# EAGLE design touch r.7 (EAGLE 7.2.0)
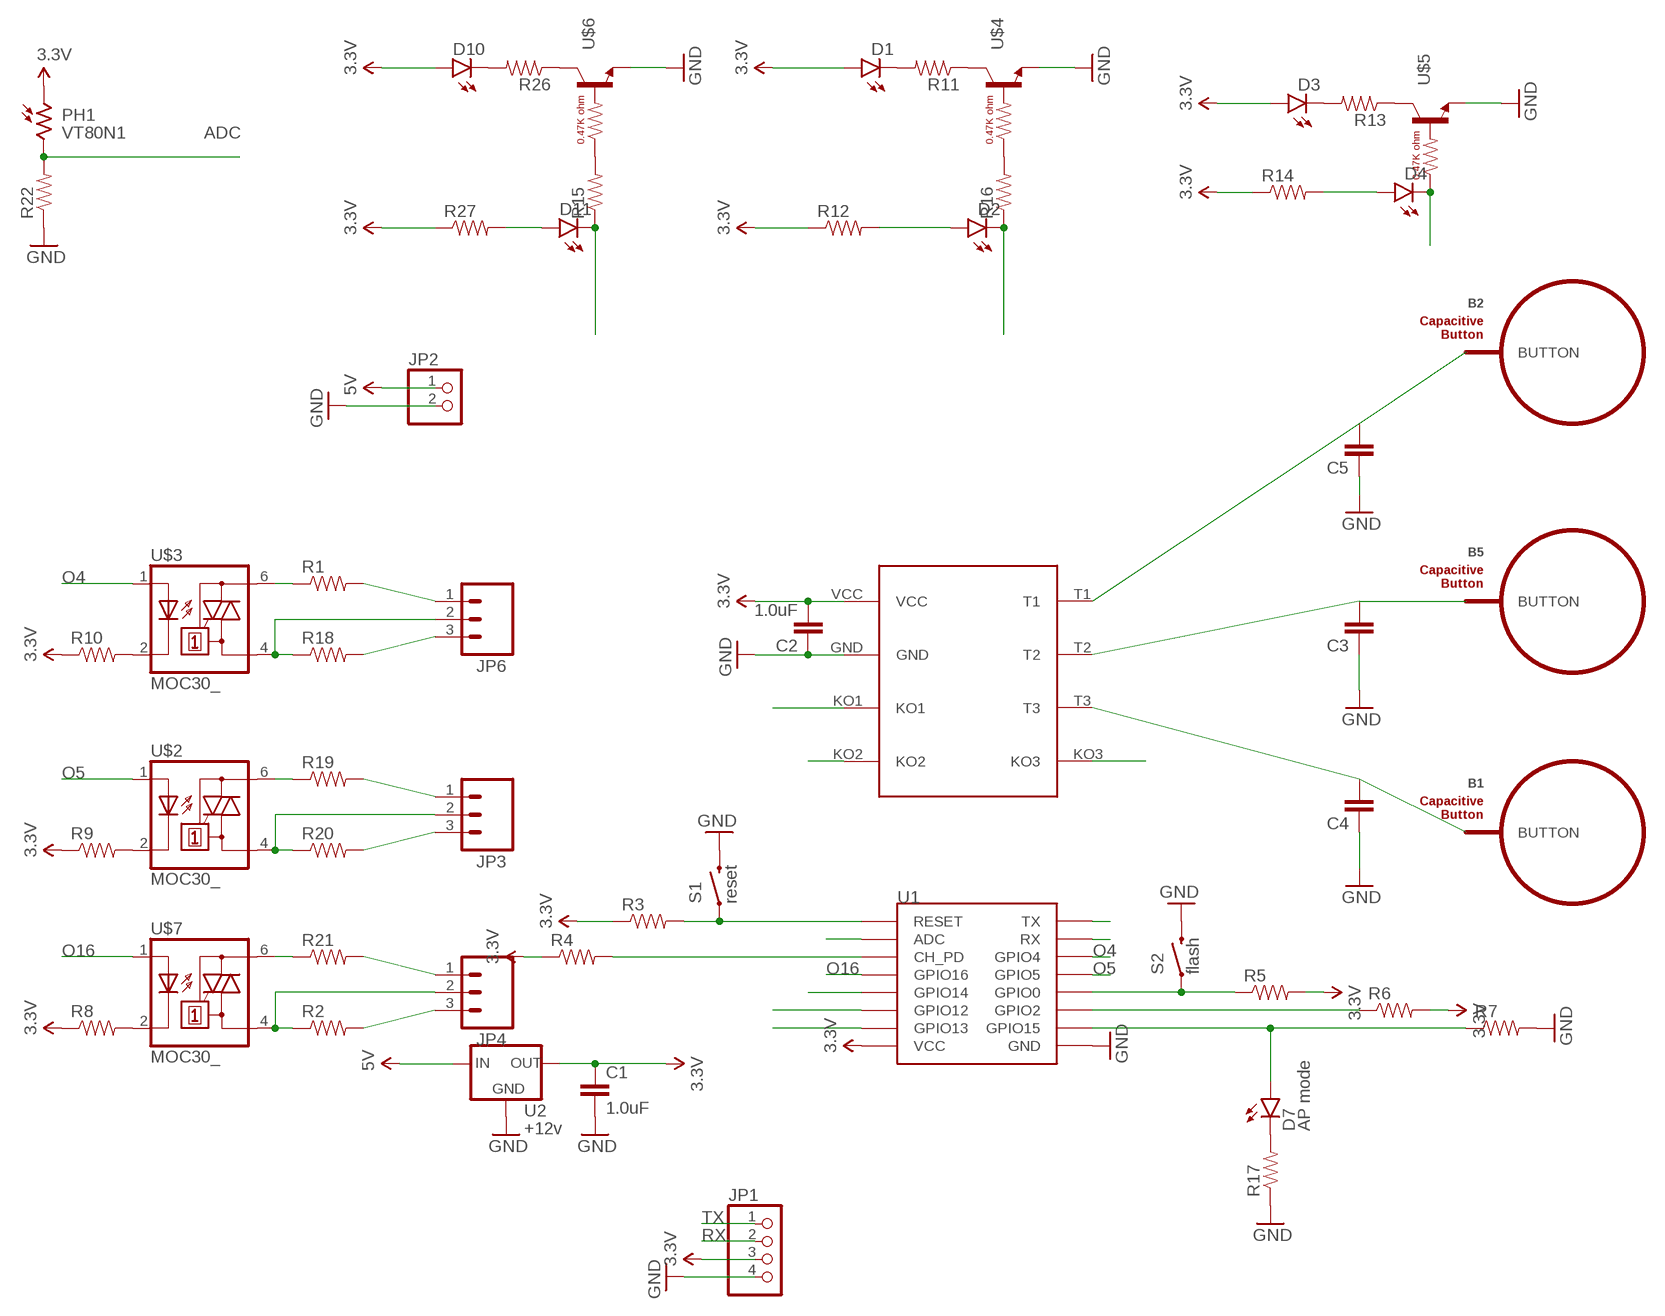
[diagram p0: schematic, sheet 1]

## Parts
B1  BUTTON_PASSIVE12MM  [BUTTON_PASSIVE_12MM]
B2  BUTTON_PASSIVE12MM  [BUTTON_PASSIVE_12MM]
B5  BUTTON_PASSIVE12MM  [BUTTON_PASSIVE_12MM]
C1  1.0uF  1.0UF50V10%(1206)  [1206]
C2  1.0uF  1.0UF50V10%(1206)  [1206]
C3  1.0UF-25V-+80/-20(0805)"  [0805-CAP]
C4  1.0UF-25V-+80/-20(0805)"  [0805-CAP]
C5  1.0UF-25V-+80/-20(0805)"  [0805-CAP]
D1  LED-GREENLILYPAD  [LED-1206]
D2  LED-GREENLILYPAD  [LED-1206]
D3  LED-GREENLILYPAD  [LED-1206]
D4  LED-GREENLILYPAD  [LED-1206]
D7  AP mode  LED-GREENLILYPAD  [LED-1206]
D10  LED-GREENLILYPAD  [LED-1206]
D11  LED-GREENLILYPAD  [LED-1206]
JP1  PINHD-1X4  [1X04]
JP2  PINHD-1X2  [1X02]
JP3  M03LONGPADS  [1X03_LONGPADS]
JP4  M03LONGPADS  [1X03_LONGPADS]
JP6  M03LONGPADS  [1X03_LONGPADS]
PH1  VT80N1  [VT800]
R1  RESISTORPTH-1/2W  [AXIAL-0.5]
R2  RESISTORPTH-1/2W  [AXIAL-0.5]
R3  0.3OHM-1/8W-1%(0805)  [0805]
R4  0.3OHM-1/8W-1%(0805)  [0805]
R5  0.3OHM-1/8W-1%(0805)  [0805]
R6  0.3OHM-1/8W-1%(0805)  [0805]
R7  0.3OHM-1/8W-1%(0805)  [0805]
R8  0.3OHM-1/8W-1%(0805)  [0805]
R9  0.3OHM-1/8W-1%(0805)  [0805]
R10  0.3OHM-1/8W-1%(0805)  [0805]
R11  0.3OHM-1/8W-1%(0805)  [0805]
R12  0.3OHM-1/8W-1%(0805)  [0805]
R13  0.3OHM-1/8W-1%(0805)  [0805]
R14  0.3OHM-1/8W-1%(0805)  [0805]
R15  0.3OHM-1/8W-1%(0805)  [0805]
R16  0.3OHM-1/8W-1%(0805)  [0805]
R17  0.3OHM-1/8W-1%(0805)  [0805]
R18  RESISTORPTH-1/2W  [AXIAL-0.5]
R19  RESISTORPTH-1/2W  [AXIAL-0.5]
R20  RESISTORPTH-1/2W  [AXIAL-0.5]
R21  RESISTORPTH-1/2W  [AXIAL-0.5]
R22  0.3OHM-1/8W-1%(0805)  [0805]
R26  0.3OHM-1/8W-1%(0805)  [0805]
R27  0.3OHM-1/8W-1%(0805)  [0805]
S1  reset  SWITCH-MOMENTARY-2SMD-1101NE  [TACTILE-SWITCH-1101NE]
S2  flash  SWITCH-MOMENTARY-2SMD-1101NE  [TACTILE-SWITCH-1101NE]
U1  ESP12SMD  [ESP12-SMD]
U2  +12v  V_REG_78XX7812  [TO-252]
U$1  BS813A  [BS813A_8PIN]
U$2  MOC30_  [MOC_]
U$3  MOC30_  [MOC_]
U$4  TRANSISTOR-NPN-DDTD142TC  [SOT23-3]
U$5  TRANSISTOR-NPN-DDTD142TC  [SOT23-3]
U$6  TRANSISTOR-NPN-DDTD142TC  [SOT23-3]
U$7  MOC30_  [MOC_]

## Nets
3.3V: C1.1 C2.2 D1.A D3.A D10.A JP1.3 PH1.1 R3.1 R4.1 R5.2 R6.2 R8.1 R9.1 R10.1 R12.1 R14.1 R27.1 U1.VCC U2.2(OUT) U$1.VCC
5V: JP2.1 U2.1(IN)
12: U1.GPIO12 U$1.KO2
13: U1.GPIO13 U$1.KO1
14: U1.GPIO14 U$1.KO3
ADC: PH1.2 R22.2 U1.ADC
GND: C1.2 C2.1 C3.1 C4.1 C5.1 JP1.4 JP2.2 R7.2 R17.1 R22.1 S1.2 S2.2 U1.GND U2.3(GND) U$1.GND U$4.2(E) U$5.2(E) U$6.2(E)
N$1: R1.P$1 U$3.6
N$2: JP6.2 R18.P$1 U$3.4
N$3: R19.P$1 U$2.6
N$4: JP3.2 R20.P$1 U$2.4
N$5: B5.BUTTON C3.2 U$1.T2
N$6: B1.BUTTON C4.2 U$1.T3
N$7: B2.BUTTON C5.2 U$1.T1
N$11: R3.2 S1.1 U1.RESET
N$12: R4.2 U1.CH_PD
N$13: R5.1 S2.1 U1.GPIO0
N$14: R6.1 U1.GPIO2
N$15: D7.A R7.1 U1.GPIO15
N$16: R8.2 U$7.2
N$18: R9.2 U$2.2
N$19: R10.2 U$3.2
N$21: D2.A R12.2
N$22: D7.C R17.2
N$23: R15.2 U$6.1(B)
N$24: R11.1 U$4.3(C)
N$25: D1.C R11.2
N$26: D4.A R14.2
N$27: R16.2 U$4.1(B)
N$28: R21.P$1 U$7.6
N$29: JP4.2 R2.P$1 U$7.4
N$30: JP6.1 R1.P$2
N$31: JP6.3 R18.P$2
N$32: JP3.1 R19.P$2
N$33: JP4.1 R21.P$2
N$34: JP3.3 R20.P$2
N$35: JP4.3 R2.P$2
N$46: R13.1 U$5.3(C)
N$47: D3.C R13.2
N$49: D11.A R27.2
N$52: R26.1 U$6.3(C)
N$54: D10.C R26.2
O4: D11.C R15.1 U1.GPIO4 U$3.1
O5: D2.C R16.1 U1.GPIO5 U$2.1
O16: D4.C U1.GPIO16 U$5.1(B) U$7.1
RX: JP1.2 U1.RXD0(RX)
TX: JP1.1 U1.TXD0(TX)

## Library data of the parts
B1 B2 B5 = PatternAgents-TouchWidgets:BUTTON_PASSIVE: Button, Passive Capacitive/Touch Sensing Type Source : http://www.PatternAgents.com Github : https://github.com/PatternAgents License : http://creativecommons.org/licenses/by-sa/3.1/ (Creative Commons 3.1) THIS SOFTWARE IS PROVIDED BY THE CONTRIBUTORS "AS IS" AND WITHOUT ANY EXPRESS OR IMPLIED WARRANTIES, INCLUDING, BUT NOT LIMITED TO, THE IMPLIED WARRANTIES OF MERCHANTABILITY AND FITNESS FOR A PARTICULAR PURPOSE ARE DISCLAIMED. IN NO EVENT SHALL THE COPYRIGHT OWNER OR CONTRIBUTORS BE LIABLE FOR ANY DIRECT, INDIRECT, INCIDENTAL, SPECIAL, EXEMPLARY, OR CONSEQUENTIAL DAMAGES (INCLUDING, BUT NOT LIMITED TO, PROCUREMENT OF SUBSTITUTE GOODS OR SERVICES; LOSS OF USE, DATA, OR PROFITS; OR BUSINESS INTERRUPTION) HOWEVER CAUSED AND ON ANY THEORY OF LIABILITY, WHETHER IN CONTRACT, STRICT LIABILITY, OR TORT (INCLUDING NEGLIGENCE OR OTHERWISE) ARISING IN ANY WAY OUT OF THE USE OF THIS SOFTWARE, EVEN IF ADVISED OF THE POSSIBILITY OF SUCH DAMAGE.
C1 C2 = SparkFun-Capacitors:1.0UF50V10%(1206): CAP-09822; PROD_ID: CAP-09822
C3-C5 = SparkFun-Capacitors:1.0UF-25V-+80/-20(0805): CAP-11625
D1-D4 D7 D10 D11 = SparkFun-LED:LED-GREEN: Various green LEDs Green LEDs used in SFE Production 0603- DIO-00821 LARGE- DIO-00862 LILYPAD- DIO-09910; PROD_ID: DIO-09910; VALUE: GREEN
JP1 = pinhead2:PINHD-1X4: PIN HEADER
JP2 = pinhead2:PINHD-1X2: PIN HEADER
JP3 JP4 JP6 = SparkFun-Connectors:M03: Header 3 Standard 3-pin 0.1" header. Use with straight break away headers (SKU : PRT-00116), right angle break away headers (PRT-00553), swiss pins (PRT-00743), machine pins (PRT-00117), and female headers (PRT-00115). Molex polarized connector foot print use with SKU : PRT-08232 with associated crimp pins and housings.
PH1 = photo-elements:VT8: Photoconductive Cell VT800 Series Source: http://optoelectronics.perkinelmer.com/content/Datasheets/DTS_vt800seriesdatasheet.pdf
R1 R2 R18-R21 = SparkFun-Resistors:RESISTOR: Resistor Basic schematic elements and footprints for 0603, 1206, and PTH resistors.
R3-R17 R22 R26 R27 = SparkFun-Resistors:0.3OHM-1/8W-1%(0805): RES-11622; PROD_ID: RES-11622; VALUE: 0.3
S1 S2 = SparkFun-Electromechanical:SWITCH-MOMENTARY-2: Various NO switches- pushbuttons, reed, etc; PROD_ID: SWCH-00815
U1 = esp8266modules:ESP12: ESP8266 Wifi module 12
U2 = SparkFun-PowerIC:V_REG_78XX: Voltage Regulator Standard 78xx regulator. IGO (Input Ground Output). Spark Fun Electronics SKU : COM-00107; PROD_ID: VREG-12370
U$1 = mysocket:BS813A
U$2 U$3 U$7 = optocoupler2:MOC30_
U$4-U$6 = SparkFun-DiscreteSemi:TRANSISTOR-NPN-DDTD142TC: NPN transistor with built in base resistor.; PROD_ID: TRANS-11480; VALUE: NPN-500mA

## Board
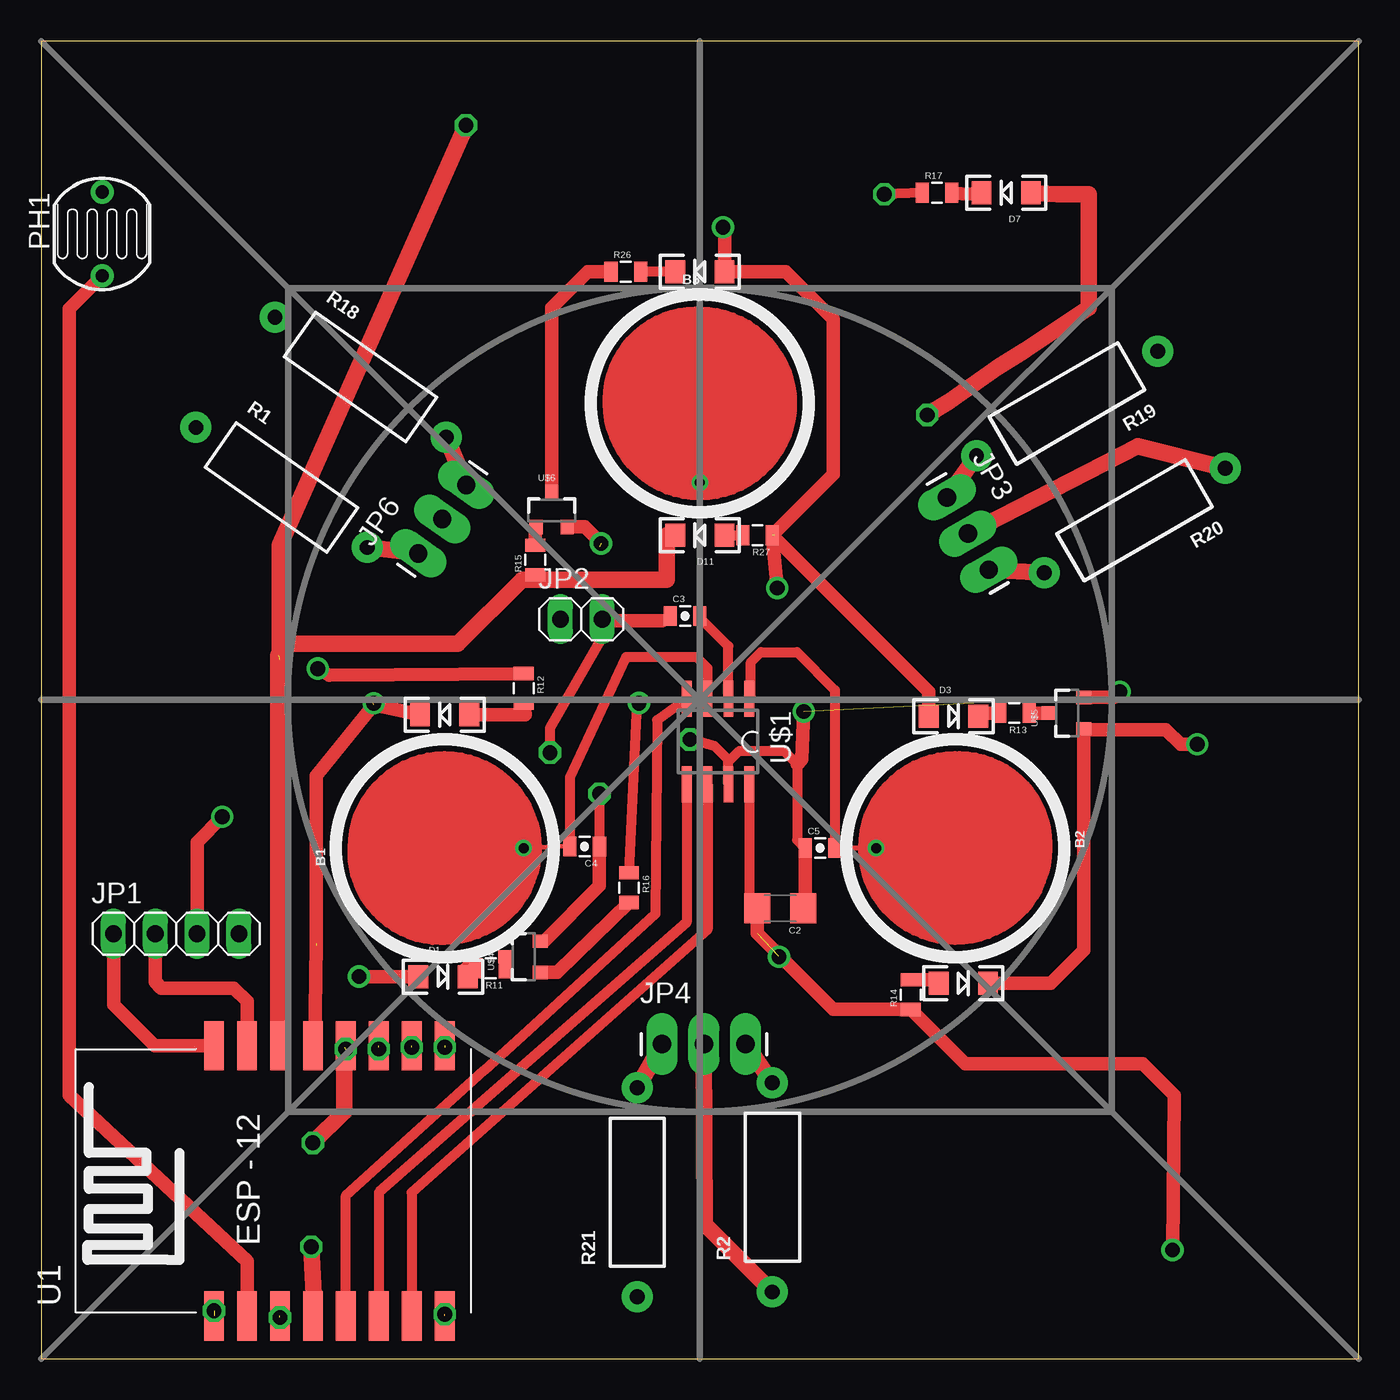
[diagram p1: board, top side]
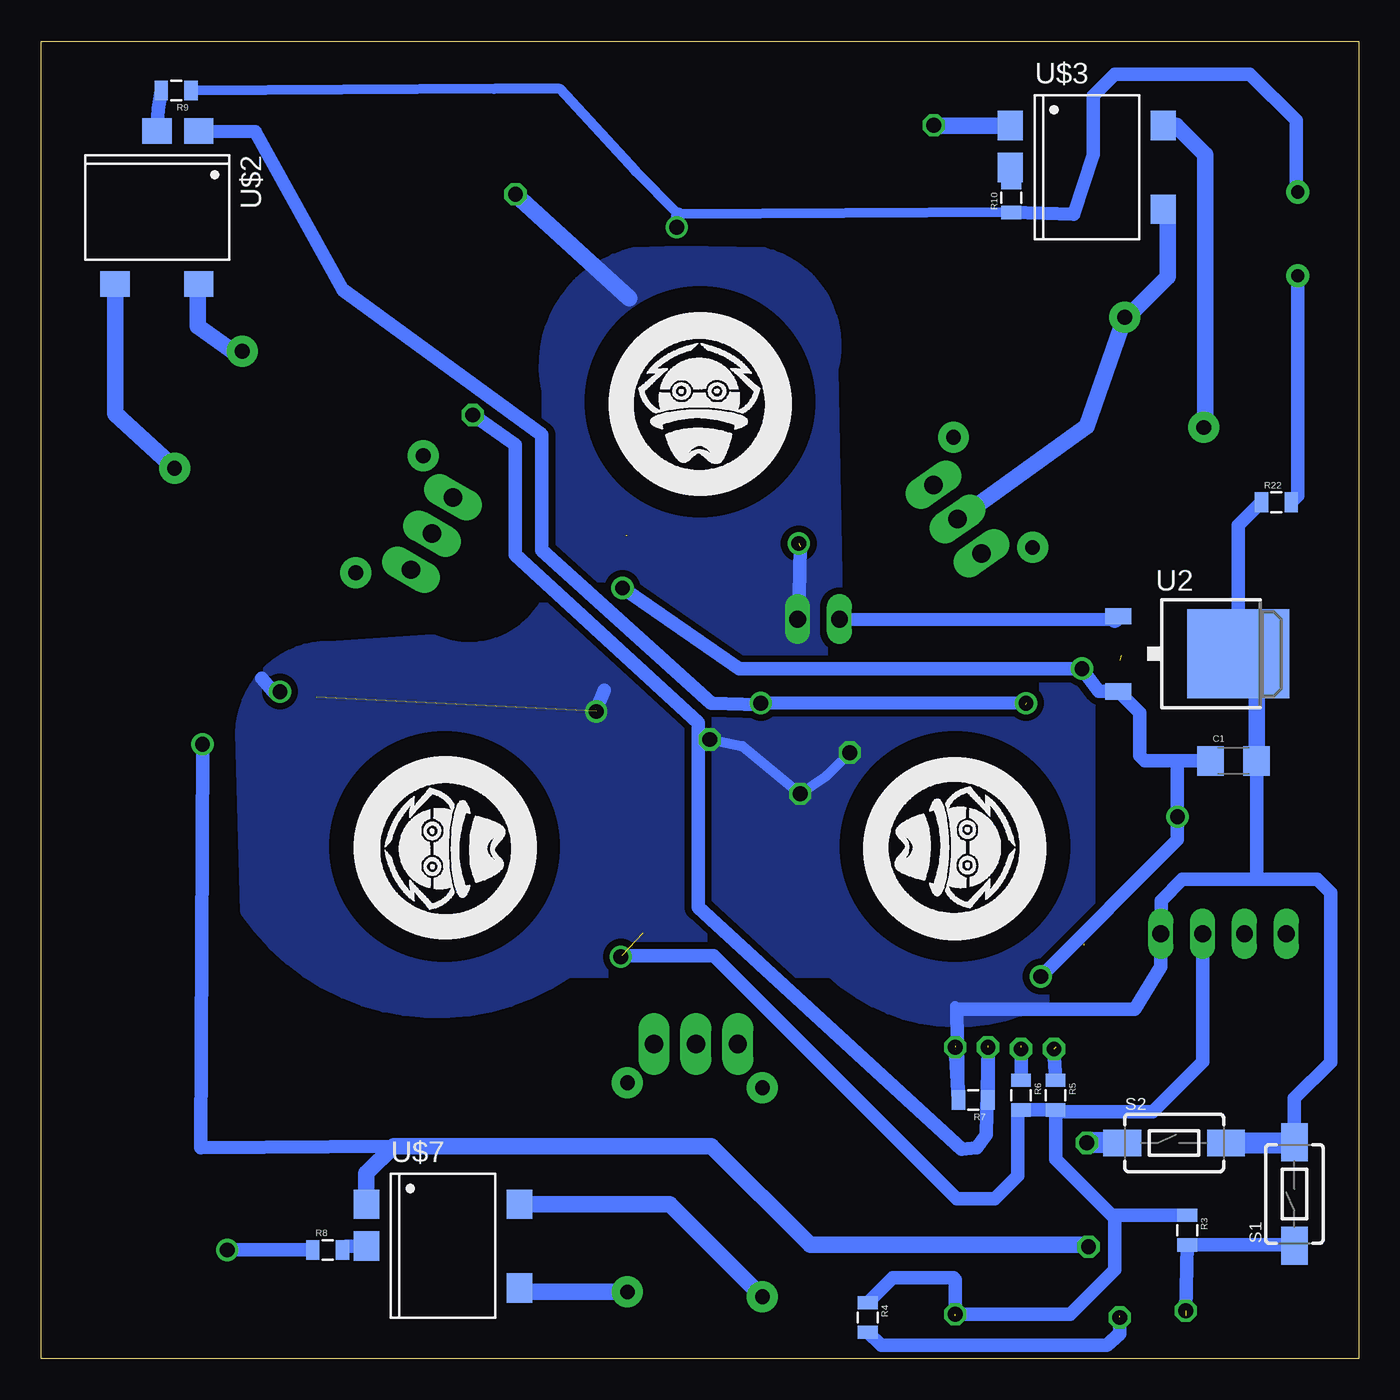
[diagram p2: board, bottom side, seen from below]

Size 80 x 80 mm. Coordinates in mm from the lower left corner, seen from the top.
Outline: 0,0 80,0 80,80 0,80 0,0
Copper layers (1*16): Top 0.035mm / dielectric 1.5mm / Bottom 0.035mm
Design rules "default *": minimum track width 20mil, minimum drill 45mil, track to track 16mil, track to pad 16mil, pad to pad 16mil, via to via 16mil, smd to smd 20mil, copper to edge 40mil, drill to drill 8mil, minimum pad ring 10mil, minimum via ring 8mil, stop-mask expansion 4mil, vias tented up to drill 0mil, thermal gap 10mil
bKeepout: area -27.4,32.8 to -14.2,46
bRestrict: area 33.2,51.3 to 46.8,64.9; area 48.7,24.3 to 62.3,37.9; area 17.7,24.3 to 31.3,37.9

### Footprints (pad centres in the part's own frame; a part is rotated, then mirrored left to right if it is on the bottom)
BUTTON_PASSIVE_12MM = drill 0.356: BUTTON 0,4.826
1206 = smd 1.6 x 1.8: 1 -1.4,0; 2 1.4,0
0805-CAP = smd 0.8 x 1.2: 1 -0.9,0; 2 0.9,0
LED-1206 = smd 1.2 x 1.4: A -1.5,0; C 1.5,0
1X04 = drill 1.016 long: 1 -3.81,0; 2 -1.27,0; 3 1.27,0; 4 3.81,0
1X02 = drill 1.016 long: 1 -1.27,0; 2 1.27,0
1X03_LONGPADS = drill 1.118 pad 1.88 long: 1 0,0; 2 2.54,0; 3 5.08,0
VT800 = drill 0.8 pad 1.4: 1 -2.54,0; 2 2.54,0
AXIAL-0.5 = drill 0.9 pad 1.88: P$1 -6.35,0; P$2 6.35,0
0805 = smd 0.8 x 1.2: 1 -0.9,0; 2 0.9,0
TACTILE-SWITCH-1101NE = smd 2.3 x 1.6: 1 -3.15,0; 2 3.15,0
ESP12-SMD = smd 3 x 1.2: ADC -8.3,3.8; CH_PD -8.3,1.8; GND 8.1,-8.2; GPIO0 8.1,-2.2; GPIO2 8.1,-4.2; GPIO4 8.1,1.8; GPIO5 8.1,-0.2; GPIO12 -8.3,-4.2; GPIO13 -8.3,-6.2; GPIO14 -8.3,-2.2; GPIO15 8.1,-6.2; GPIO16 -8.3,-0.2; RESET -8.3,5.8; RXD0 8.1,3.8; TXD0 8.1,5.8; VCC -8.3,-8.2
TO-252 = smd 1 x 1.6: 1 -2.28,-4.8; 2 2.28,-4.8 | smd 5.4 x 6.2: 3 0,2.5
BS813A_8PIN = smd 0.6 x 2.2: GND -0.735,2.83; KO1 0.535,2.83; KO2 1.805,2.83; KO3 1.805,-2.37; T1 -2.005,-2.37; T2 -0.735,-2.37; T3 0.535,-2.37; VCC -2.005,2.83
MOC_ = smd 1.78 x 1.52: 1 -1.27,-4.645; 2 1.27,-4.645; 4 3.81,4.645; 6 -1.27,4.645
SOT23-3 = smd 0.8 x 0.9: 1 -0.95,-1; 2 0.95,-1; 3 0,1.1

### Placement (x,y rotation side)
B1  24.5,31 270 top
B2  55.5,31 90 top
B5  40,58 180 top
C1  7.6,36.3 0 bottom
C2  44.88,27.35 180 top
C3  39.1,45.1 0 top
C4  33,31.1 180 top
C5  47.3,31 0 top
D1  24.4,23.2 0 top
D2  24.5,39.1 180 top
D3  55.4,39 0 top
D4  56,22.8 0 top
D7  58.6,70.8 180 top
D10  40,66 180 top
D11  40,50 180 top
JP1  8.2,25.8 0 top
JP2  32.8,44.9 0 top
JP3  55,52.3 300 top
JP4  37.7,19.1 0 top
JP6  22.9,48.9 55 top
PH1  3.7,68.3 270 top
R1  14.6,52.9 325 top
R2  44.4,10.4 90 top
R3  10.4,7.8 270 bottom
R4  29.8,2.5 270 bottom
R5  18.4,16 270 bottom
R6  20.5,16 270 bottom
R7  23.4,15.7 180 bottom
R8  62.6,6.6 0 bottom
R9  71.8,77 180 bottom
R10  21.1,70.5 90 bottom
R11  27.3,23.7 180 top
R12  29.3,40.7 270 top
R13  59.1,39.2 180 top
R14  52.8,22.1 90 top
R15  30,48.5 90 top
R16  35.7,28.6 270 top
R17  54.4,70.8 0 top
R18  19.4,59.6 325 top
R19  62.3,58 210 top
R20  66.4,50.9 210 top
R21  36.2,10.1 90 top
R22  5,52 0 bottom
R26  35.5,66 0 top
R27  43.5,50 180 top
S1  3.9,10 90 bottom
S2  11.2,13.1 0 bottom
U1  16.3,10.9 90 top
U2  9.8,42.8 270 bottom
U$1  41,37.7 180 top
U$2  71.7,69.9 180 bottom
U$3  16.5,73.6 270 bottom
U$4  29.3,24.4 90 top
U$5  62.3,39.2 90 top
U$6  31,51.5 0 top
U$7  55.6,8.1 270 bottom

### Tracks (layer width: path | path; a pad name or v marks a point on that pad's centre or on a via)
3.3V  (via drill 0.9)  (3 unrouted)
  Top 0.61: U$1.VCC 43.01,26.96 C2.2
  Top 0.813: v41.4,68.7 41.5,68.6 D10.A 45.2,66 48.1,63.1 48.1,53.7 R27.1 53.9,40.5 D3.A | C2.2 43.48,25.82 48.1,21.2 R14.1 56.1,17.9 66.9,17.9 68.8,16 v68.7,6.6 | v16.8,41.9 17.5,41.5 R12.1 | JP1.3 9.47,31.37 v11,32.9 | 44.5,50 44.4,49.9 v44.7,46.8 | D1.A v19.3,23.2
  Bottom 0.61: 18.3,15 R5.2 | 14.8,8.5 15,8.7 | R10.1 41.3,69.5 43.9,72.1 48.5,77.1 52.5,77.1 R9.1
  Bottom 0.813: R4.1 28.3,4.9 24.6,4.9 24.5,4.8 24.5,2.7 17.5,2.7 14.8,5.4 14.8,8.5 | R3.1 15,8.7 18.4,12.1 R5.2 R6.2 20.7,14.9 20.7,11.1 22.1,9.7 24.4,9.7 39.15,24.45 44.75,24.45 | JP1.3 9.47,18.03 12.5,15 18.3,15 | v41.4,68.7 41.4,69 41.3,69.5 | R10.1 17.3,69.5 16.1,73.1 16.1,76.7 14.8,78 6.6,78 3.8,75.2 3.8,70.94 PH1.1 | C1.1 11,36.3 | 11,36.3 13,36.3 13.3,36.6 13.3,39.22 U2.2 15.78,40.52 v16.8,41.9 37.6,41.9 v44.7,46.8 | 11,36.3 v11,32.9 11,31.5 v19.3,23.2 | v68.7,6.6 R8.1
5V
  Bottom 0.813: 14.81,44.87 JP2.1
  Bottom 1.016: U2.1 14.81,44.87
12
  Top 0.61: U$1.KO2 39.2,26.5 20.5,10.1 U1.GPIO12
13
  Top 0.61: U$1.KO1 40.47,26.07 22.5,10.1 U1.GPIO13
14
  Top 0.61: U$1.KO3 37.4,38.77 37.3,27 29.2,19.6 26.9,17.5 18.5,9.9 U1.GPIO14
ADC
  Top 0.813: U1.ADC 12.5,5.9 1.7,16 1.7,63.76 PH1.2
  Bottom 0.813: R22.2 3.7,52.4 PH1.2
GND  (via drill 0.9)  (3 unrouted)
  Top 0.61: C5.1 45.9,31.5 45.9,36.1 45.1,36.9 42.4,36.9 41.73,36.23 U$1.GND 41.73,36.37 40.9,37.2 v39.4,37.6 | 36.5,44.8 35.9,44.9 34.03,44.83 JP2.2 34,44.83 34.7,44.9 30.9,38.3 v30.9,36.8 | 37.7,44.8 38.1,45 C3.1 | R17.1 v51.2,70.7 | v33.9,34.3 C4.1
  Top 0.813: 37.7,44.8 36.5,44.8 34.1,44.8 v34,44.9 | 24.6,20 24.5,20 U1.GND | U$6.2 33,50.5 34,49.5 | C5.1 46.4,27.47 C2.1 | U$5.2 65.15,40.15 v65.5,40.5 | 45.9,36.1 46.2,36.4 v46.3,39.3 | U$4.2 30.55,25.35 33.9,28.7 C4.1
  Bottom 0.61: 24.5,21.4 24.4,21.2 | JP1.4 | 6.2,29.5 6.6,29.1 | v39.4,37.6 37.4,37.2 v33.9,34.3 32.3,35.4 v30.9,36.8
  Bottom 0.813: 24.5,18.9 R7.2 24.4,21.2 13.6,21.2 12.01,23.79 JP1.4 | R22.1 7.3,50.6 U2.3 | S1.2 3.9,15.8 1.7,18 1.7,28.3 2.5,29.1 6.6,29.1 10.7,29.1 12,27.8 JP1.4 | C1.2 6.2,29.5 | v34,44.9 33.9,49.3 | v65.5,40.5 65.9,40.5 66.6,41.3 | v46.3,39.3 46.2,39.6 45.8,40.6
  Bottom 1.016: U2.3 6,42.5 6.2,42.5 C1.2 | 44.3,64.4 v51.2,70.7
  Bottom 1.27: S2.2 3.95,13.1 S1.2
  pour Bottom (no thermals): 41.2,67.3 36.1,67.2 arc90 31.9,60.1 31.6,44.5 arc-90 30.7,42.7 20,42.7 arc90 16.3,40.3 16.3,23.9 arc90 32,23.4 48,23.4 arc90 67.6,27.1 67.9,38 arc90 62.5,43.3 56.2,43.7 arc-90 49.2,46.3 49.3,58.8 arc90 44,67.2
N$1
  Bottom 1.016: U$3.6 11.07,74.87 9.3,73.1 9.3,56.64 R1.P$1
N$2
  Bottom 1.016: U$3.4 11.6,69.53 11.6,65.7 14.06,63.24 R18.P$1 16.5,56.6 JP6.2
N$3
  Bottom 1.016: R19.P$1 68.38,61.17 70.5,62.7 70.5,64.72 U$2.6
N$4
  Top 1.016: R20.P$1 66.6,55.4 JP3.2
  Bottom 1.016: U$2.4 75.51,57.39 R20.P$1
N$5
  Top 0.305: B5.BUTTON C3.2
  Top 0.61: U$1.T2 41.73,43.27 40,45 C3.2
N$6
  Top 0.305: C4.2 B1.BUTTON
  Top 0.61: U$1.T3 40.47,41.94 39.8,42.6 35.5,42.6 32.1,35.3 C4.2
N$7
  Top 0.305: B2.BUTTON C5.2
  Top 0.61: U$1.T1 43.1,40.16 43.1,42.3 43.7,42.9 45.9,42.9 48.2,40.6 C5.2
N$8  (via drill 0.9)
  other vias: 18.5,18.8
N$9  (via drill 0.9)
  other vias: 20.5,18.8
N$10  (via drill 0.9)
  other vias: 24.5,18.9
N$11  (via drill 0.9)  (1 unrouted)
  Bottom 0.61: 3.95,6.9 S1.1
  Bottom 0.813: v10.5,2.9 R3.2 3.95,6.9
N$12  (1 unrouted)
  Bottom 0.813: R4.2 29,0.8 15.3,0.8 14.5,1.5 14.5,2.5
N$13  (via drill 0.9)  (1 unrouted)
  Top 1.016: v16.5,13.1 18.4,15 18.4,18.9 U1.GPIO0
  Bottom 0.813: R5.1 18.5,18.8
  Bottom 1.27: S2.1 v16.5,13.1
N$14  (1 unrouted)
  Bottom 0.813: R6.1 20.5,18.9
N$15  (via drill 0.9)  (1 unrouted)
  Top 1.016: v53.8,57.3 55.1,58.1 58.1,60.2 59.7,61.2 63.6,63.8 63.6,70.7 61.7,70.7 D7.A
  Bottom 0.813: R7.1 22.5,18.9 22.6,13.6 23.2,12.8 24.1,12.7 40.1,27.4 40.1,38.6 51.2,48.8 51.2,55.5 v53.8,57.3
N$16
  Bottom 0.813: 60.27,6.8 U$7.2 61.47,6.83 R8.2
N$17  (via drill 0.9)
  other vias: 16.4,6.8
N$18
  Bottom 0.813: R9.2 72.9,75.88 U$2.2
N$19
  Bottom 0.813: R10.2 21.21,72.4 U$3.2
N$21
  Top 0.813: R12.2 29.4,39.1 D2.A
N$22
  Top 0.813: R17.2 56.2,70.7 D7.C
N$23
  Top 0.813: R15.2 30,50.45 U$6.1
N$24
  Top 0.813: R11.1 U$4.3
N$25
  Top 0.813: D1.C 25.8,23.7 R11.2
N$26
  Top 0.813: R14.2 54.3,23 D4.A
N$27
  Top 0.813: U$4.1 31.35,23.45 R16.2
N$28
  Bottom 1.016: U$7.6 41.82,9.37 R21.P$1
N$29
  Top 1.016: R2.P$1 40.3,8.15 JP4.2
  Bottom 1.016: R2.P$1 50.72,4.05 U$7.4
N$30
  Top 1.016: JP6.1 R1.P$2
N$31
  Top 1.016: R18.P$2 JP6.3
N$32
  Top 1.016: R19.P$2 JP3.1
N$33
  Top 1.016: JP4.1 R21.P$2
N$34
  Top 1.016: R20.P$2 JP3.3
N$35
  Top 1.016: JP4.3 R2.P$2
N$36  (via drill 0.9)
  other vias: 22.5,18.9
N$37  (via drill 0.9)
  other vias: 14.5,2.5
N$38  (via drill 0.9)
  other vias: 24.5,2.7
N$40  (via drill 0.9)
  other vias: 41.4,68.7
N$41  (via drill 0.9)
  other vias: 16.5,13.1
N$46
  Top 0.813: U$5.3 R13.1
N$47
  Top 0.813: R13.2 57.1,39.2 D3.C
N$48  (via drill 0.9)
  other vias: 34,49.5
N$49
  Top 0.61: D11.A R27.2
N$51  (via drill 0.9)
  other vias: 65.5,40.5
N$52
  Top 0.813: U$6.3 31,63.8 33.2,66 R26.1
N$54
  Top 0.61: D10.C R26.2
N$55  (via drill 0.9)
  other vias: 20.2,39.8
N$56  (via drill 0.9)
  other vias: 44.8,24.4
N$57  (via drill 0.6)
  other vias: 50.7,31
N$58  (via drill 0.6)
  other vias: 29.3,31
N$59  (via drill 0.6)
  other vias: 40,53.2
O4  (via drill 0.9)  (1 unrouted)
  Top 0.61: R15.1 32,47.3
  Top 1.016: U1.GPIO4 14.4,19.1 14.4,42.7 15.1,43.4 25.3,43.4 29.2,47.3 32,47.3 38,47.3 38,50 D11.C | 14.5,42.4 14.5,49.4 v25.8,74.9
  Bottom 1.016: U$3.1 25.77,74.87 v25.8,74.9
O5  (via drill 0.9)  (2 unrouted)
  Top 0.61: R16.1 36.2,39.8
  Top 0.813: D2.C 20.2,39.7 16.7,35.4 16.7,25.1 | 16.7,25.2 16.6,19.1 U1.GPIO5 | 36.2,39.8 v36.3,39.81
  Bottom 0.813: U$2.1 67,74.5 61.7,64.9 49.6,56.1 49.6,49.1 39.3,39.8 36.4,39.71 | 36.4,39.71 v36.3,39.81 | v36.3,39.81 20.16,39.83 | v36.3,39.81 36.3,39.61 36.4,39.71
O16  (via drill 0.9)
  Top 0.813: D4.C 61.3,22.8 63.3,24.8 U$5.1 63.35,38.2 68.3,38.2 69.2,37.3 v70.2,37.3
  Top 1.016: U1.GPIO16 16.6,2.7 v16.4,6.8
  Bottom 0.813: 58.6,12.9 70.3,12.8 v70.2,37.3
  Bottom 1.016: v16.4,6.8 16.5,6.9 33.3,6.9 39.3,12.9 58.6,12.9 60.24,11.26 U$7.1
RX
  Top 0.813: U1.RXD0 12.5,21.7 11.7,22.5 7.3,22.5 6.93,22.87 JP1.2
TX
  Top 0.813: JP1.1 4.4,21.5 6.9,19 U1.TXD0